# EAGLE schematic combo_10_01_2017 (EAGLE 6.6.0)
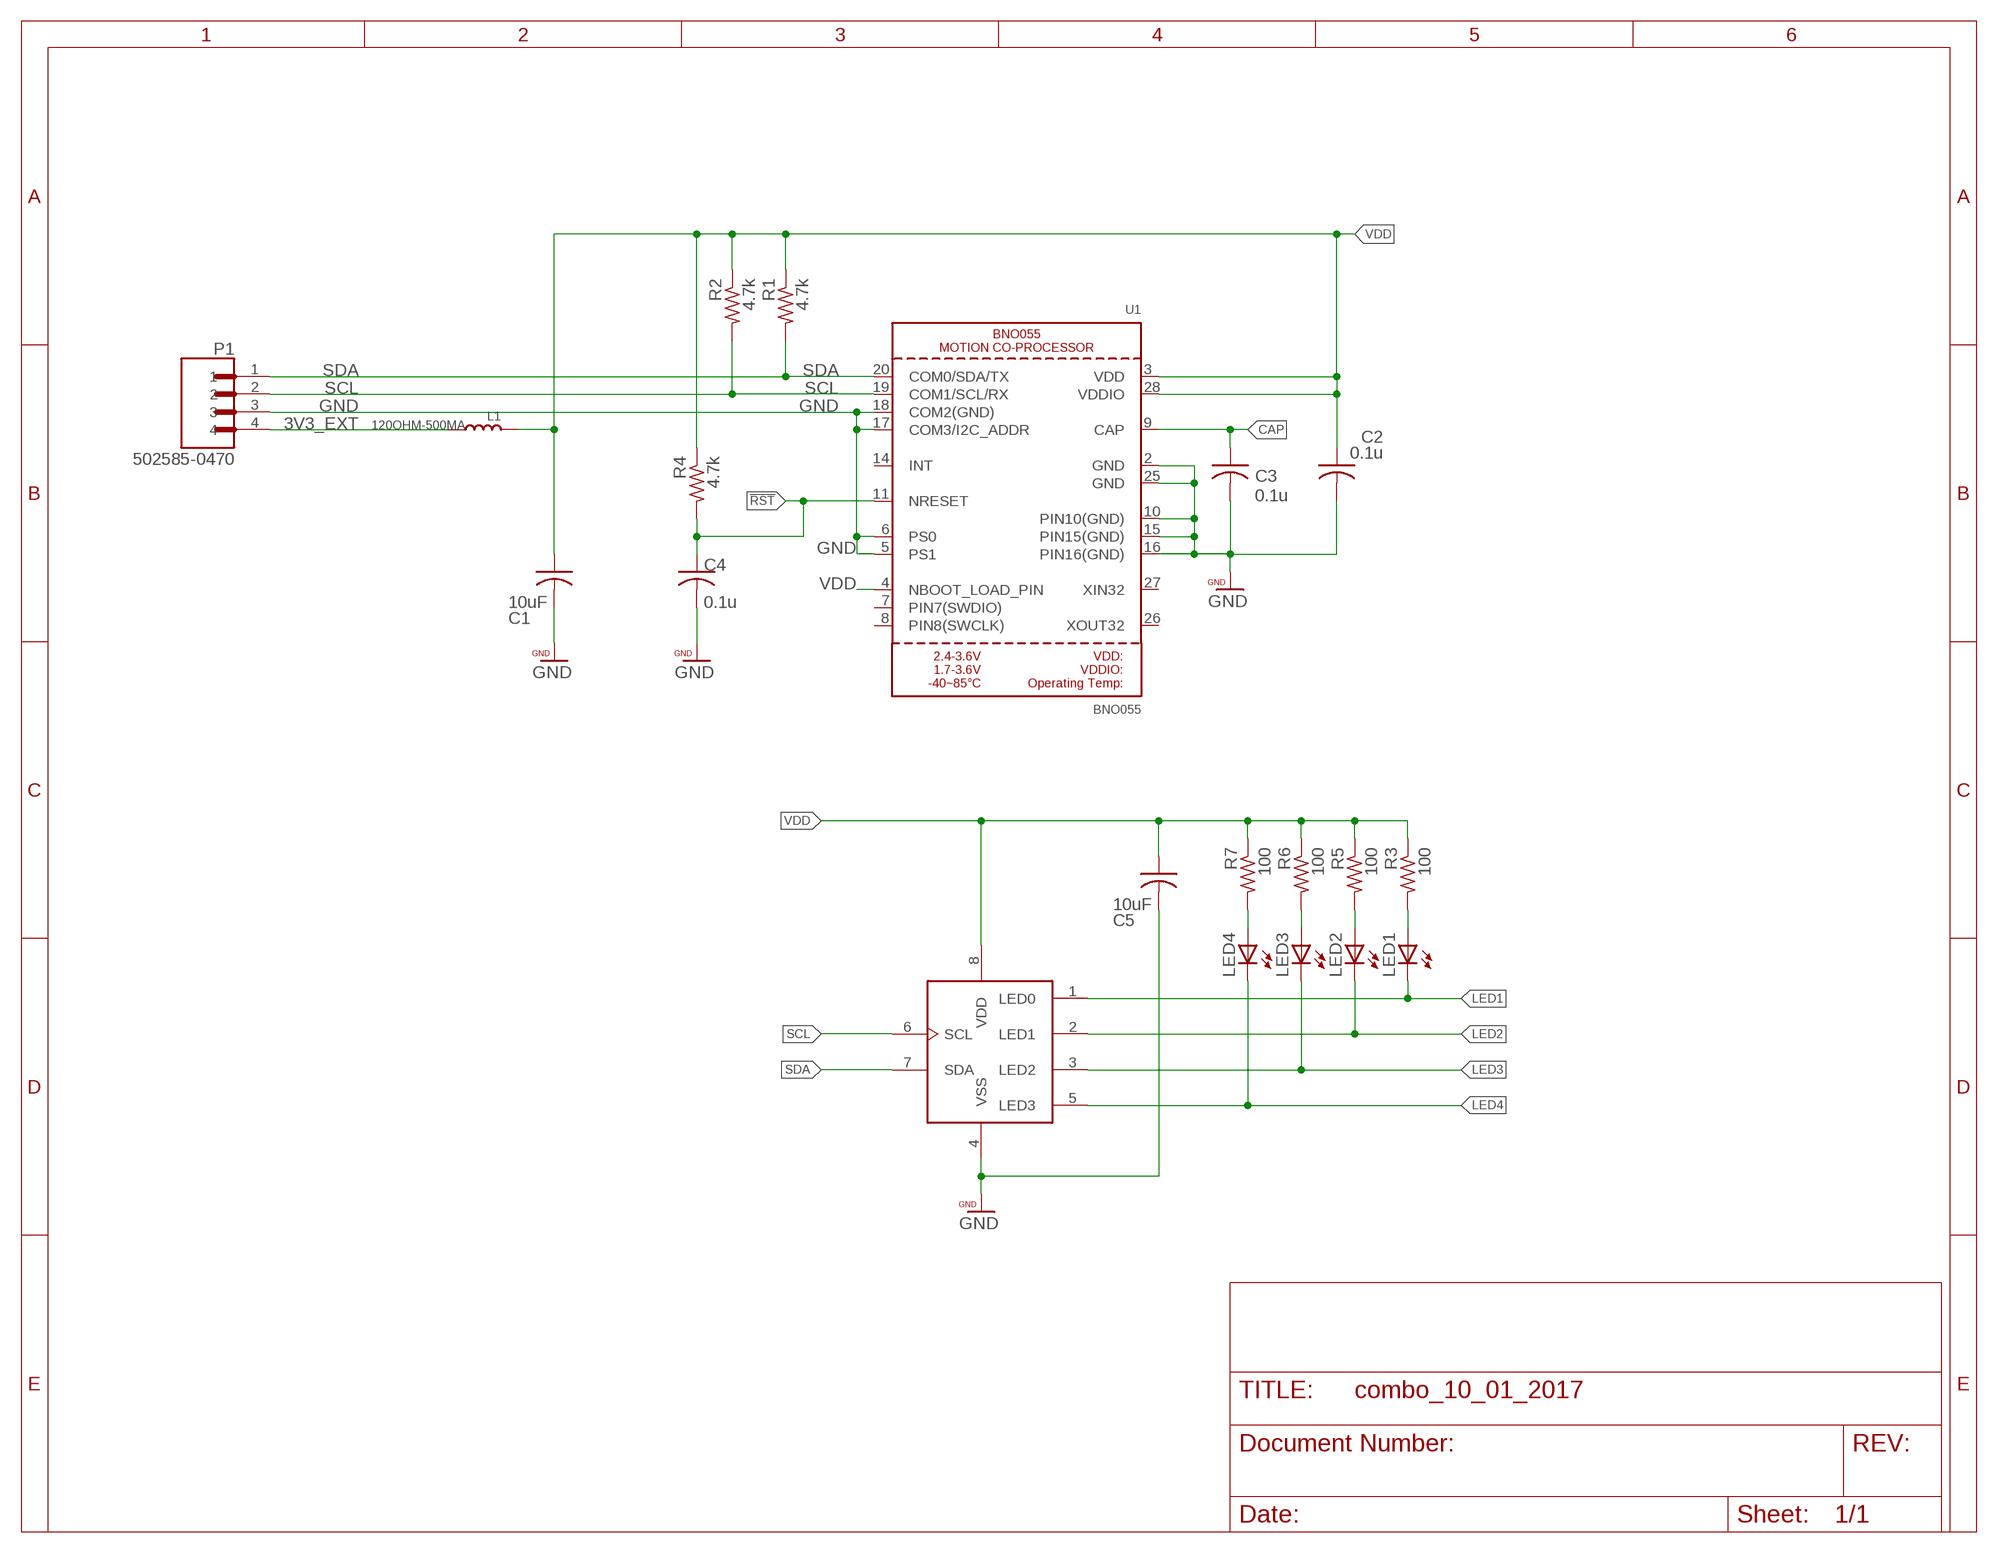
[diagram p0: schematic, sheet 1]

## Parts
C1  10uF  C-USC0402  [C0402]
C2  0.1u  C-USC0402  [C0402]
C3  0.1u  C-USC0402  [C0402]
C4  0.1u  C-USC0402  [C0402]
C5  10uF  C-USC0402  [C0402]
L1  120OHM-500MA  SMD-FERRITE-CHIP-120-OHM-500MA(0603)  [L0603]
LED1  LEDCHIP-LED0603  [CHIP-LED0603]
LED2  LEDCHIP-LED0603  [CHIP-LED0603]
LED3  LEDCHIP-LED0603  [CHIP-LED0603]
LED4  LEDCHIP-LED0603  [CHIP-LED0603]
P1  502585-0470  [MOLEX_502585-0470]
R1  4.7k  R-US_R0402  [R0402]
R2  4.7k  R-US_R0402  [R0402]
R3  100  R-US_R0402  [R0402]
R4  4.7k  R-US_R0402  [R0402]
R5  100  R-US_R0402  [R0402]
R6  100  R-US_R0402  [R0402]
R7  100  R-US_R0402  [R0402]
U1  BNO055  [BNO055]
U2  PCA9533DP  [TSSOP8]

## Nets
3V3_EXT: L1.2 P1.4
!RST: C4.1 R4.2 U1.11(NRESET)
CAP: C3.1 U1.9(CAP)
GND: C1.2 C2.2 C3.2 C4.2 C5.2 P1.3 U1.2(GND) U1.5(PS1) U1.6(PS0) U1.10(PIN10(GND)) U1.15(PIN15(GND)) U1.16(PIN16(GND)) U1.17(COM3/I2C_ADDR) U1.18(COM2(GND)) U1.25(GND) U2.4(VSS)
LED1: LED1.C U2.1(LED0)
LED2: LED2.C U2.2(LED1)
LED3: LED3.C U2.3(LED2)
LED4: LED4.C U2.5(LED3)
N$2: LED1.A R3.2
N$9: LED2.A R5.2
N$10: LED3.A R6.2
N$11: LED4.A R7.2
SCL: P1.2 R2.2 U1.19(COM1/SCL/RX) U2.6(SCL)
SDA: P1.1 R1.2 U1.20(COM0/SDA/TX) U2.7(SDA)
VDD: C1.1 C2.1 C5.1 L1.1 R1.1 R2.1 R3.1 R4.1 R5.1 R6.1 R7.1 U1.3(VDD) U1.4(NBOOT_LOAD_PIN) U1.28(VDDIO) U2.8(VDD)
Unconnected: U1.7(PIN7(SWDIO)) U1.8(PIN8(SWCLK)) U1.14(INT) U1.26(XOUT32) U1.27(XIN32)

## Library data of the parts
C1-C5 = rcl:C-US: CAPACITOR, American symbol
L1 = halcyonmod_Passives:SMD-FERRITE-CHIP-120-OHM-500MA(0603): 303030001; MPN: BLM18AG121SN1D
LED1-LED4 = led:LED: LED OSRAM: - CHIPLED LG R971, LG N971, LY N971, LG Q971, LY Q971, LO R971, LY R971 LH N974, LH R974 LS Q976, LO Q976, LY Q976 LO Q996 - Hyper CHIPLED LW Q18S LB Q993, LB Q99A, LB R99A - SideLED LS A670, LO A670, LY A670, LG A670, LP A670 LB A673, LV A673, LT A673, LW A673 LH A674 LY A675 LS A676, LA A676, LO A676, LY A676, LW A676 LS A679, LY A679, LG A679 - Hyper Micro SIDELED® LS Y876, LA Y876, LO Y876, LY Y876 LT Y87S - SmartLED LW L88C, LW L88S LB L89C, LB L89S, LG L890 LS L89K, LO L89K, LY L89K LS L896, LA L896, LO L896, LY L896 - TOPLED LS T670, LO T670, LY T670, LG T670, LP T670 LSG T670, LSP T670, LSY T670, LOP T670, LYG T670 LG T671, LOG T671, LSG T671 LB T673, LV T673, LT T673, LW T673 LH T674 LS T676, LA T676, LO T676, LY T676, LB T676, LH T676, LSB T676, LW T676 LB T67C, LV T67C, LT T67C, LS T67K, LO T67K, LY T67K, LW E67C LS E67B, LA E67B, LO E67B, LY E67B, LB E67C, LV E67C, LT E67C LW T67C LS T679, LY T679, LG T679 LS T770, LO T770, LY T770, LG T770, LP T770 LB T773, LV T773, LT T773, LW T773 LH T774 LS E675, LA E675, LY E675, LS T675 LS T776, LA T776, LO T776, LY T776, LB T776 LHGB T686 LT T68C, LB T68C - Hyper Mini TOPLED® LB M676 - Mini TOPLED Santana® LG M470 LS M47K, LO M47K, LY M47K Source: http://www.osram.convergy.de LUXEON: - LUMILED® LXK2-PW12-R00, LXK2-PW12-S00, LXK2-PW14-U00, LXK2-PW14-V00 LXK2-PM12-R00, LXK2-PM12-S00, LXK2-PM14-U00 LXK2-PE12-Q00, LXK2-PE12-R00, LXK2-PE12-S00, LXK2-PE14-T00, LXK2-PE14-U00 LXK2-PB12-K00, LXK2-PB12-L00, LXK2-PB12-M00, LXK2-PB14-N00, LXK2-PB14-P00, LXK2-PB14-Q00 LXK2-PR12-L00, LXK2-PR12-M00, LXK2-PR14-Q00, LXK2-PR14-R00 LXK2-PD12-Q00, LXK2-PD12-R00, LXK2-PD12-S00 LXK2-PH12-R00, LXK2-PH12-S00 LXK2-PL12-P00, LXK2-PL12-Q00, LXK2-PL12-R00 Source: www.luxeon.com KINGBRIGHT: KA-3528ASYC Source: www.kingbright.com
P1 = 502585-0470:502585-0470: 1.50mm Pitch CLIK-Mate™ Wire-to-Board PCB Receptacle, Single Row, Right Angle, 4 Circuits; AVAILABILITY: Good; DESCRIPTION: 1.50mm Pitch CLIK-Mate™ Wire-to-Board PCB Receptacle, Single Row, Right Angle, 4 Circuits; MF: Molex; MP: 502585-0470; PACKAGE: None; PRICE: 0.44 USD
R1-R7 = rcl:R-US_: RESISTOR, American symbol
U1 = microbuilder:BNO055: BNO055 - Motion Co-Processor
U2 = PatternAgents-NXP:PCA9533: PCA9533D/01: LED driver and dimmer 4 channel, PWM @ 8 bit resolution 25mA / channel sink external resistors per LED I2C protocol @ 400kHz (fast) digikey: 568-3372-5-ND, 8-SOIC, $1.92